# Altium schematic sheet 14-SoC POWER4.SchDoc
size 513 x 386 mm
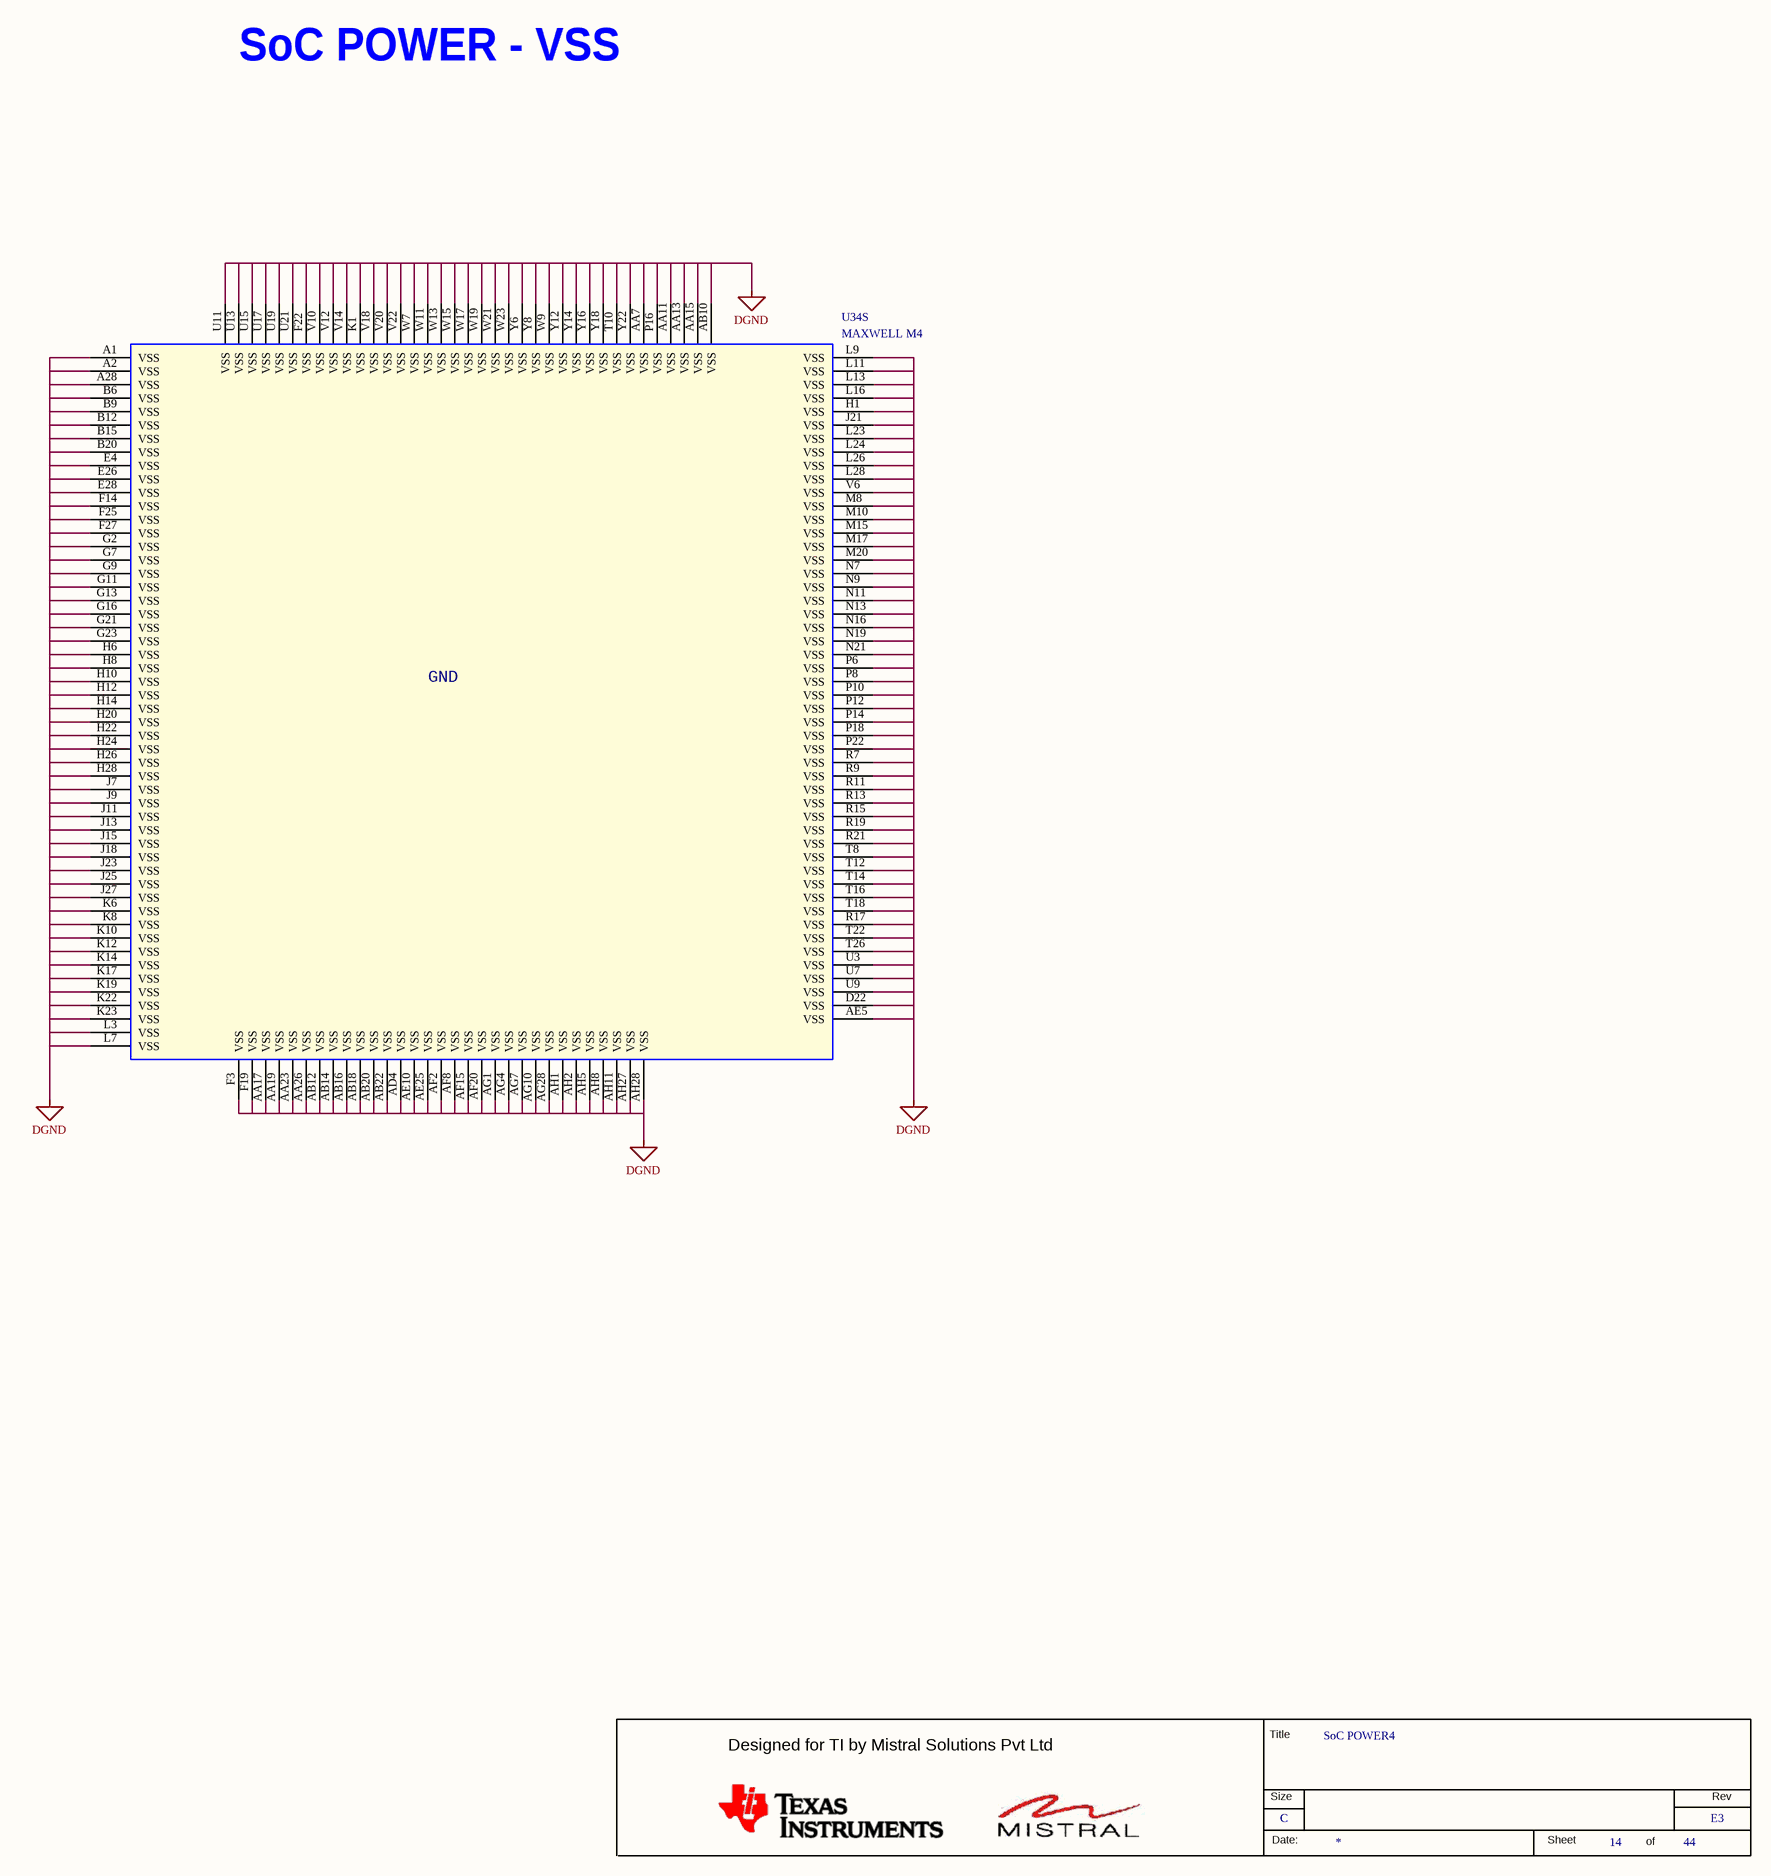
[diagram p0: 14-SoC POWER4.SchDoc]

## Parts
*  RevCode: E3  Title: SoC POWER4  Page Size: C  Page Number: 14  Page Count: 44  (hidden comment: MISTRAL_TITLEBLK_CSIZE)  (graphical)
U34  MAXWELL M4  [BGA784_31-49_910X910_1-7]  (part S of 19)

## Nets
DGND: U34.A1(VSS) U34.A2(VSS) U34.A28(VSS) U34.AA7(VSS) U34.AA11(VSS) U34.AA13(VSS) U34.AA15(VSS) U34.AA17(VSS) U34.AA19(VSS) U34.AA23(VSS) U34.AA26(VSS) U34.AB10(VSS) U34.AB12(VSS) U34.AB14(VSS) U34.AB16(VSS) U34.AB18(VSS) U34.AB20(VSS) U34.AB22(VSS) U34.AD4(VSS) U34.AE5(VSS) U34.AE10(VSS) U34.AE25(VSS) U34.AF2(VSS) U34.AF8(VSS) U34.AF15(VSS) U34.AF20(VSS) U34.AG1(VSS) U34.AG4(VSS) U34.AG7(VSS) U34.AG10(VSS) U34.AG28(VSS) U34.AH1(VSS) U34.AH2(VSS) U34.AH5(VSS) U34.AH8(VSS) U34.AH11(VSS) U34.AH27(VSS) U34.AH28(VSS) U34.B6(VSS) U34.B9(VSS) U34.B12(VSS) U34.B15(VSS) U34.B20(VSS) U34.D22(VSS) U34.E4(VSS) U34.E26(VSS) U34.E28(VSS) U34.F3(VSS) U34.F14(VSS) U34.F19(VSS) U34.F22(VSS) U34.F25(VSS) U34.F27(VSS) U34.G2(VSS) U34.G7(VSS) U34.G9(VSS) U34.G11(VSS) U34.G13(VSS) U34.G16(VSS) U34.G21(VSS) U34.G23(VSS) U34.H1(VSS) U34.H6(VSS) U34.H8(VSS) U34.H10(VSS) U34.H12(VSS) U34.H14(VSS) U34.H20(VSS) U34.H22(VSS) U34.H24(VSS) U34.H26(VSS) U34.H28(VSS) U34.J7(VSS) U34.J9(VSS) U34.J11(VSS) U34.J13(VSS) U34.J15(VSS) U34.J18(VSS) U34.J21(VSS) U34.J23(VSS) U34.J25(VSS) U34.J27(VSS) U34.K1(VSS) U34.K6(VSS) U34.K8(VSS) U34.K10(VSS) U34.K12(VSS) U34.K14(VSS) U34.K17(VSS) U34.K19(VSS) U34.K22(VSS) U34.K23(VSS) U34.L3(VSS) U34.L7(VSS) U34.L9(VSS) U34.L11(VSS) U34.L13(VSS) U34.L16(VSS) U34.L23(VSS) U34.L24(VSS) U34.L26(VSS) U34.L28(VSS) U34.M8(VSS) U34.M10(VSS) U34.M15(VSS) U34.M17(VSS) U34.M20(VSS) U34.N7(VSS) U34.N9(VSS) U34.N11(VSS) U34.N13(VSS) U34.N16(VSS) U34.N19(VSS) U34.N21(VSS) U34.P6(VSS) U34.P8(VSS) U34.P10(VSS) U34.P12(VSS) U34.P14(VSS) U34.P16(VSS) U34.P18(VSS) U34.P22(VSS) U34.R7(VSS) U34.R9(VSS) U34.R11(VSS) U34.R13(VSS) U34.R15(VSS) U34.R17(VSS) U34.R19(VSS) U34.R21(VSS) U34.T8(VSS) U34.T10(VSS) U34.T12(VSS) U34.T14(VSS) U34.T16(VSS) U34.T18(VSS) U34.T22(VSS) U34.T26(VSS) U34.U3(VSS) U34.U7(VSS) U34.U9(VSS) U34.U11(VSS) U34.U13(VSS) U34.U15(VSS) U34.U17(VSS) U34.U19(VSS) U34.U21(VSS) U34.V6(VSS) U34.V10(VSS) U34.V12(VSS) U34.V14(VSS) U34.V18(VSS) U34.V20(VSS) U34.V22(VSS) U34.W7(VSS) U34.W9(VSS) U34.W11(VSS) U34.W13(VSS) U34.W15(VSS) U34.W17(VSS) U34.W19(VSS) U34.W21(VSS) U34.W23(VSS) U34.Y6(VSS) U34.Y8(VSS) U34.Y12(VSS) U34.Y14(VSS) U34.Y16(VSS) U34.Y18(VSS) U34.Y22(VSS)

## Notes on the sheet
- SoC POWER - VSS
- (in symbol AM654X_BGA784, part S) GND
- (in symbol MISTRAL_TITLEBLK_CSIZE) Title; Designed for TI by Mistral Solutions Pvt Ltd; Size; Rev; Date:; Sheet; of

## Library data of the parts
* = MISTRAL_TITLEBLK_CSIZE: Issue: 1.0; Page Create Date: March  8, 1995; Page Modify Date: *
U34 = AM654X_BGA784: IC MAXWELL MICRO CONTROLLER UNIT BGA784; Mistral Part No: 141217100003; Mfr_name: TEXAS INSTRUMENTS; Mfr_part_number: MAXWELL M4_EVM; Part_type: ICS\DIGITAL\MICROCONTROLLER; Project: TI_MAXIE_CPB; Tolerance: NA; Customs_HS_Code: 85423100; Custom_Duty: 15%; Voltage: NA; Wattage: NA; Package: BGA784; Distributor_name: NA; Distributor_part_number: NA; Height: 1.63MM; Weight: NA; Temperature: NA; Datasheet: Y:\MIS_DATABASE\DATASHEETS\ICS\DIGITAL\MICROCONTROLLER\MAXWELLM4.PDF; Crtd /date: MANIRAJA/130717; Chkd/date: MANIRAJA/130717; MECHANICAL 3D STEP FILE: BGA784_31-49_910X910_1-7; PCB Footprint: BGA784_31-49_910X910_1-7; Library Ref: AM654X_BGA784